# EAGLE design uc4h slcan adapter v101 (EAGLE 7.5.0)
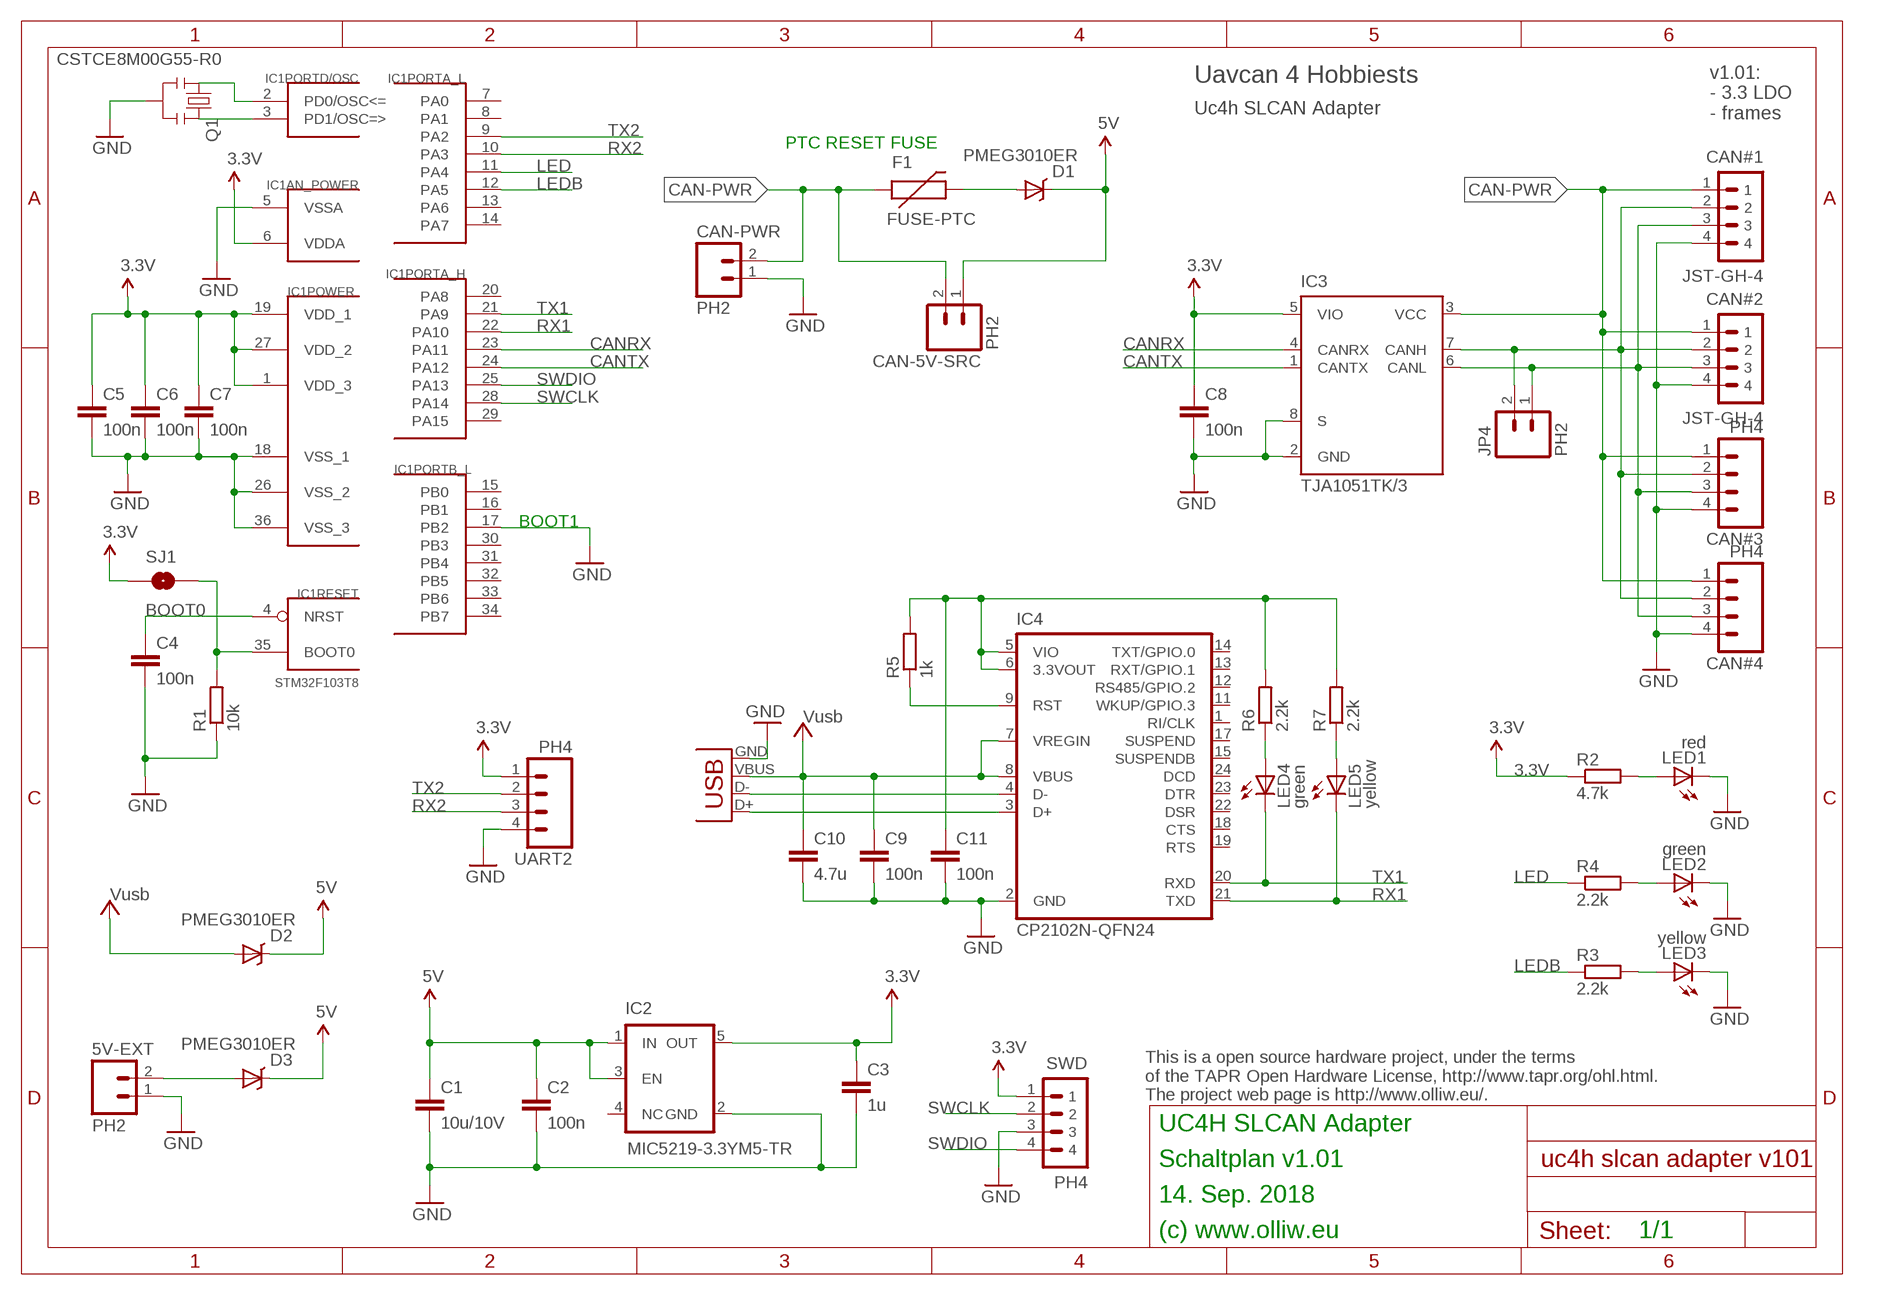
[diagram p0: schematic, sheet 1]

## Parts
5V-EXT  PH2  M02PTH  [1X02]
C1  10u/10V  C-EUC1206  [C1206]
C2  100n  C-EUC0603K  [C0603K]
C3  1u  C-EUC0603K  [C0603K]
C4  100n  C-EUC0603K  [C0603K]
C5  100n  C-EUC0603K  [C0603K]
C6  100n  C-EUC0603K  [C0603K]
C7  100n  C-EUC0603K  [C0603K]
C8  100n  C-EUC0603K  [C0603K]
C9  100n  C-EUC0603K  [C0603K]
C10  4.7u  C-EUC0805  [C0805]
C11  100n  C-EUC0603K  [C0603K]
CAN#1  JST-GH-4  [SM04B-GHS-TB]
CAN#2  JST-GH-4  [SM04B-GHS-TB]
CAN#3  PH4  M04PTH  [1X04]
CAN#4  PH4  M04PTH  [1X04]
CAN-5V-SRC  PH2  M02PTH  [1X02]
CAN-PWR  PH2  M02PTH  [1X02]
D1  PMEG3010ER  DIODE-SCHOTTKYSOD123-W  [SOD123W-DIODE]
D2  PMEG3010ER  DIODE-SCHOTTKYSOD123-W  [SOD123W-DIODE]
D3  PMEG3010ER  DIODE-SCHOTTKYSOD123-W  [SOD123W-DIODE]
F1  FUSE-PTC  [FUSE-1206]
IC1  STM32F103T8  STM32F10XTXU6  [VFQFPN36]
IC2  MIC5219-3.3YM5-TR  V_REG_TPS76433SOT23-5  [SOT23-5]
IC3  TJA1051TK/3  [HVSON8]
IC4  CP2102N-QFN24  [QFN24-CP2102N]
JP4  PH2  M02PTH  [1X02]
LED1  red  LEDCHIPLED_0603  [CHIPLED_0603]
LED2  green  LEDCHIPLED_0603  [CHIPLED_0603]
LED3  yellow  LEDCHIPLED_0603  [CHIPLED_0603]
LED4  green  LEDCHIPLED_0603  [CHIPLED_0603]
LED5  yellow  LEDCHIPLED_0603  [CHIPLED_0603]
Q1  CSTCE8M00G55-R0  RESONATORSMD  [RESONATOR-SMD]
R1  10k  R-EU_R0603  [R0603]
R2  4.7k  R-EU_R0603  [R0603]
R3  2.2k  R-EU_R0603  [R0603]
R4  2.2k  R-EU_R0603  [R0603]
R5  1k  R-EU_R0603  [R0603]
R6  2.2k  R-EU_R0603  [R0603]
R7  2.2k  R-EU_R0603  [R0603]
SJ1  BOOT0  SOLDERJUMPERNO  [SJ_2S-NO]
SWD  PH4  P4X1_1P27-OCT_BILEX  [4X1_1P27_OCT_BILEX]
UART2  PH4  M04PTH  [1X04]
USB  Amphenol 10118192-0001LF  USB-MICROB  [USB-MICROB]

## Nets
3.3V: C3.1 C5.1 C6.1 C7.1 C8.1 IC1.1(POWER:VDD_3) IC1.6(AN_POWER:VDDA) IC1.19(POWER:VDD_1) IC1.27(POWER:VDD_2) IC2.5(OUT) IC3.5(VIO) R2.1 SJ1.1 SWD.1 UART2.1
3.3V-CP2102: C11.1 IC4.5(VIO) IC4.6(3.3VOUT) R5.2 R6.2 R7.2
5V: C1.1 C2.1 CAN-5V-SRC.1 D1.C D2.C D3.C IC2.1(IN) IC2.3(EN)
5V-CAN-FUSE: D1.A F1.4
CAN-PWR: CAN#1.1 CAN#2.1 CAN#3.1 CAN#4.1 CAN-5V-SRC.2 CAN-PWR.2 F1.3 IC3.3(VCC)
CANH: CAN#1.2 CAN#2.2 CAN#3.2 CAN#4.2 IC3.7(CANH) JP4.2
CANL: CAN#1.3 CAN#2.3 CAN#3.3 CAN#4.3 IC3.6(CANL) JP4.1
CANRX: IC1.23(PORTA_H:PA11) IC3.4(CANRX)
CANTX: IC1.24(PORTA_H:PA12) IC3.1(CANTX)
GND: 5V-EXT.1 C1.2 C2.2 C3.2 C4.2 C5.2 C6.2 C7.2 C8.2 C9.2 C10.2 C11.2 CAN#1.4 CAN#2.4 CAN#3.4 CAN#4.4 CAN-PWR.1 IC1.5(AN_POWER:VSSA) IC1.17(PORTB_L:PB2) IC1.18(POWER:VSS_1) IC1.26(POWER:VSS_2) IC1.36(POWER:VSS_3) IC2.2(GND) IC3.2(GND) IC3.8(S) IC4.2(GND) LED1.C LED2.C LED3.C Q1.2 R1.1 SWD.3 UART2.4 USB.GND
LED: IC1.11(PORTA_L:PA4) R4.1
LEDB: IC1.12(PORTA_L:PA5) R3.1
N$1: C4.1 IC1.4(RESET:NRST)
N$2: LED3.A R3.2
N$3: IC1.35(RESET:BOOT0) R1.2 SJ1.2
N$5: IC1.2(PORTD/OSC:PD0/OSC<=) Q1.1
N$6: IC1.3(PORTD/OSC:PD1/OSC=>) Q1.3
N$8: LED2.A R4.2
N$9: LED1.A R2.2
N$10: 5V-EXT.2 D3.A
N$12: IC4.9(RST) R5.1
N$14: LED4.A R6.1
N$15: IC4.4(D-) USB.D-
N$16: LED5.A R7.1
N$17: IC4.3(D+) USB.D+
RX1: IC1.22(PORTA_H:PA10) IC4.21(TXD) LED5.C
RX2: IC1.10(PORTA_L:PA3) UART2.3
SWCLK: IC1.28(PORTA_H:PA14) SWD.2
SWDIO: IC1.25(PORTA_H:PA13) SWD.4
TX1: IC1.21(PORTA_H:PA9) IC4.20(RXD) LED4.C
TX2: IC1.9(PORTA_L:PA2) UART2.2
VUSB: C9.1 C10.1 D2.A IC4.7(VREGIN) IC4.8(VBUS) USB.VBUS ; supply symbol labelled Vusb
Unconnected: IC1.7(PORTA_L:PA0) IC1.8(PORTA_L:PA1) IC1.13(PORTA_L:PA6) IC1.14(PORTA_L:PA7) IC1.15(PORTB_L:PB0) IC1.16(PORTB_L:PB1) IC1.20(PORTA_H:PA8) IC1.29(PORTA_H:PA15) IC1.30(PORTB_L:PB3) IC1.31(PORTB_L:PB4) IC1.32(PORTB_L:PB5) IC1.33(PORTB_L:PB6) IC1.34(PORTB_L:PB7) IC2.4(NC) IC4.1(RI/CLK) IC4.11(WKUP/GPIO.3) IC4.12(RS485/GPIO.2) IC4.13(RXT/GPIO.1) IC4.14(TXT/GPIO.0) IC4.15(SUSPENDB) IC4.17(SUSPEND) IC4.18(CTS) IC4.19(RTS) IC4.22(DSR) IC4.23(DTR) IC4.24(DCD)

## Notes on the sheet
- v1.01:
  - 3.3 LDO
  - frames
- Uavcan 4 Hobbiests
- Uc4h SLCAN Adapter
- PTC RESET FUSE
- BOOT1
- This is a open source hardware project, under the terms
  of the TAPR Open Hardware License, http://www.tapr.org/ohl.html.
  The project web page is http://www.olliw.eu/.
- UC4H SLCAN Adapter
- Schaltplan v1.01
- 14. Sep. 2018
- (c) www.olliw.eu | 1/1

## Library data of the parts
5V-EXT CAN-5V-SRC CAN-PWR JP4 = # SparkFun2:M02: Header 2 Standard 2-pin 0.1" header. Use with straight break away headers (SKU : PRT-00116), right angle break away headers (PRT-00553), swiss pins (PRT-00743), machine pins (PRT-00117), and female headers (PRT-00115). Molex polarized connector foot print use with SKU : PRT-08233 with associated crimp pins and housings.
C1-C11 = rcl:C-EU: CAPACITOR, European symbol
CAN#1 CAN#2 = # stdlib:JST-GH-4
CAN#3 CAN#4 UART2 = # SparkFun2:M04: Header 4 Standard 4-pin 0.1" header. Use with straight break away headers (SKU : PRT-00116), right angle break away headers (PRT-00553), swiss pins (PRT-00743), machine pins (PRT-00117), and female headers (PRT-00115). Molex polarized connector foot print use with SKU : PRT-08231 with associated crimp pins and housings. 1MM SMD Version SKU: PRT-10208
D1-D3 = # stdlib:DIODE-SCHOTTKY
F1 = # stdlib:FUSE-PTC
IC1 = # stm32:STM32F10XTXU6: STM32F101/103 36pad VFQPFN36
IC2 = # SparkFun2:V_REG_TPS76433: Voltage Regulator Older TI part. LDO 150mA regulator. No output by-pass cap option. See V_REG_LDO for a better part.
IC3 = # stdlib:TJA1051TK/3
IC4 = # stdlib:CP2102N-QFN24
LED1-LED5 = led:LED: LED OSRAM: - CHIPLED LG R971, LG N971, LY N971, LG Q971, LY Q971, LO R971, LY R971 LH N974, LH R974 LS Q976, LO Q976, LY Q976 LO Q996 - Hyper CHIPLED LW Q18S LB Q993, LB Q99A, LB R99A - SideLED LS A670, LO A670, LY A670, LG A670, LP A670 LB A673, LV A673, LT A673, LW A673 LH A674 LY A675 LS A676, LA A676, LO A676, LY A676, LW A676 LS A679, LY A679, LG A679 - Hyper Micro SIDELED® LS Y876, LA Y876, LO Y876, LY Y876 LT Y87S - SmartLED LW L88C, LW L88S LB L89C, LB L89S, LG L890 LS L89K, LO L89K, LY L89K LS L896, LA L896, LO L896, LY L896 - TOPLED LS T670, LO T670, LY T670, LG T670, LP T670 LSG T670, LSP T670, LSY T670, LOP T670, LYG T670 LG T671, LOG T671, LSG T671 LB T673, LV T673, LT T673, LW T673 LH T674 LS T676, LA T676, LO T676, LY T676, LB T676, LH T676, LSB T676, LW T676 LB T67C, LV T67C, LT T67C, LS T67K, LO T67K, LY T67K, LW E67C LS E67B, LA E67B, LO E67B, LY E67B, LB E67C, LV E67C, LT E67C LW T67C LS T679, LY T679, LG T679 LS T770, LO T770, LY T770, LG T770, LP T770 LB T773, LV T773, LT T773, LW T773 LH T774 LS E675, LA E675, LY E675, LS T675 LS T776, LA T776, LO T776, LY T776, LB T776 LHGB T686 LT T68C, LB T68C - Hyper Mini TOPLED® LB M676 - Mini TOPLED Santana® LG M470 LS M47K, LO M47K, LY M47K Source: http://www.osram.convergy.de LUXEON: - LUMILED® LXK2-PW12-R00, LXK2-PW12-S00, LXK2-PW14-U00, LXK2-PW14-V00 LXK2-PM12-R00, LXK2-PM12-S00, LXK2-PM14-U00 LXK2-PE12-Q00, LXK2-PE12-R00, LXK2-PE12-S00, LXK2-PE14-T00, LXK2-PE14-U00 LXK2-PB12-K00, LXK2-PB12-L00, LXK2-PB12-M00, LXK2-PB14-N00, LXK2-PB14-P00, LXK2-PB14-Q00 LXK2-PR12-L00, LXK2-PR12-M00, LXK2-PR14-Q00, LXK2-PR14-R00 LXK2-PD12-Q00, LXK2-PD12-R00, LXK2-PD12-S00 LXK2-PH12-R00, LXK2-PH12-S00 LXK2-PL12-P00, LXK2-PL12-Q00, LXK2-PL12-R00 Source: www.luxeon.com KINGBRIGHT: KA-3528ASYC Source: www.kingbright.com
Q1 = # SparkFun2:RESONATOR: Resonator Small SMD resonator. This is the itty bitty 10/20MHz resonators with built in caps. CSTCE10M0G55 and CSTCE20M0V53. Footprint has been reviewed closely but hasn't been tested yet.
R1-R7 = rcl:R-EU_: RESISTOR, European symbol
SJ1 = # SparkFun2:SOLDERJUMPER: Solder Jumper Standard SMD solder jumper. Used to automate production. Two varients : Normally Open and Normally Closed are the same, but have different paste layers. NC will have a large amount of paste and should jumper during reflow.
SWD = # stdlib:P4X1_1P27
USB = # SparkFun2:USB: USB Connectors USB-B-PTH is fully proven SKU : PRT-00139 USB-miniB is fully proven SKU : PRT-00587 USB-A-PCB is untested. USB-A-H is throughly reviewed, but untested. Spark Fun Electronics SKU : PRT-00437 USB-B-SMT is throughly reviewed, but untested. Needs silkscreen touching up. USB-A-S has not been used/tested USB-MB-H has not been used/tested

## Board
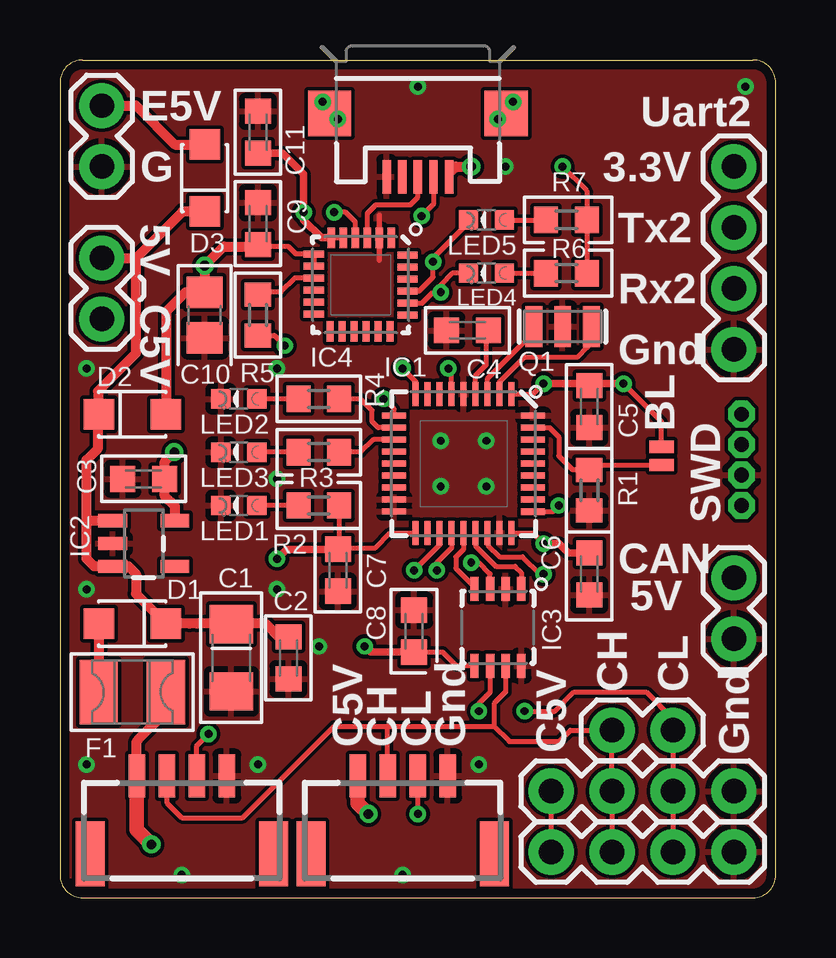
[diagram p1: board, top side]
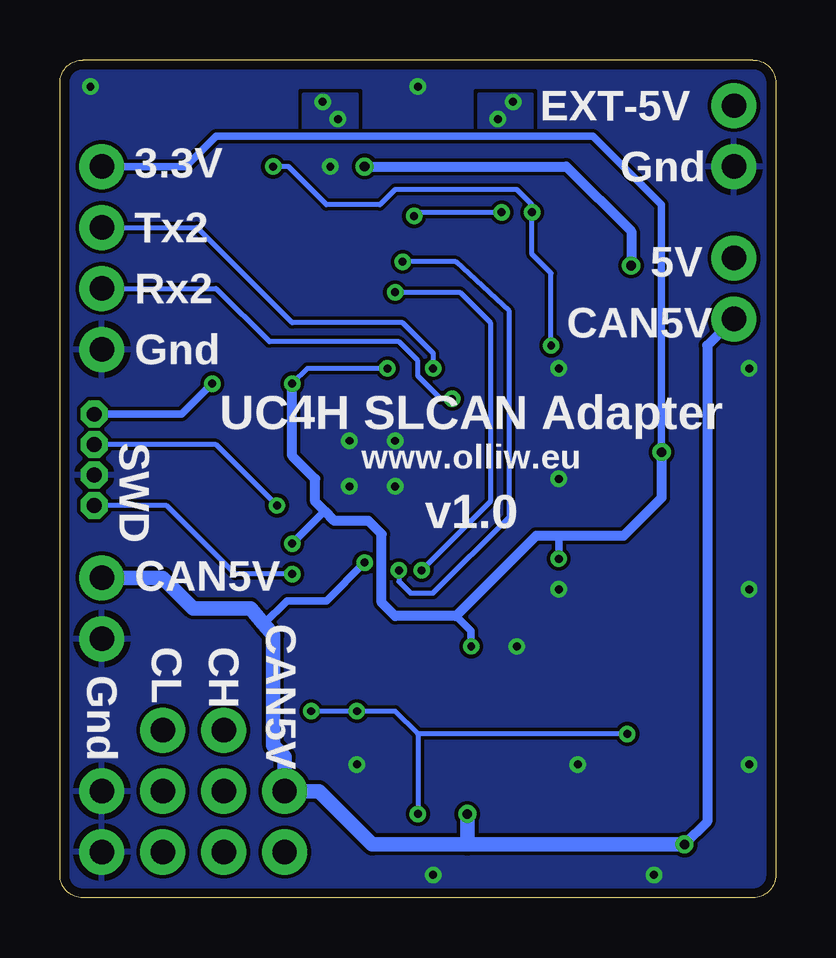
[diagram p2: board, bottom side, seen from below]

Size 29.84 x 34.92 mm. Coordinates in mm from the lower left corner, seen from the top.
Outline: 0.95,34.92 28.89,34.92 arc-90 29.84,33.97 29.84,0.95 arc-90 28.89,0 0.95,0 arc-90 0,0.95 0,33.97 arc-90 0.95,34.92
Copper layers (1*16): Top 0.0356mm / dielectric 1.5011mm / Bottom 0.0356mm
Design rules "ow-oshpark-2layer": minimum track width 6mil, minimum drill 13mil, track to track 6mil, track to pad 6mil, pad to pad 6mil, via to via 6mil, smd to smd 6mil, copper to edge 15mil, drill to drill 6mil, minimum pad ring 7mil, minimum via ring 7mil, stop-mask expansion 2.5mil, vias tented up to drill 26mil, thermal gap 10mil

### Footprints (pad centres in the part's own frame; a part is rotated, then mirrored left to right if it is on the bottom)
1X02 = drill 1.016 pad 1.88: 1 0,0; 2 2.54,0
C1206 = smd 1.6 x 1.8: 1 -1.4,0; 2 1.4,0
C0603K = smd 1.05 x 1.08: 1 -0.875,0; 2 0.875,0
C0805 = smd 1.3 x 1.5: 1 -0.95,0; 2 0.95,0
SM04B-GHS-TB = smd 0.7 x 1.8: 1 -1.875,4.6; 2 -0.625,4.6; 3 0.625,4.6; 4 1.875,4.6 | smd 1.2 x 2.7: FIT@1 -3.825,1.35; FIT@2 3.825,1.35
1X04 = drill 1.016 pad 1.88: 1 0,0; 2 2.54,0; 3 5.08,0; 4 7.62,0
SOD123W-DIODE = smd 1.27 x 1.27: A -1.4,0; C 1.4,0
FUSE-1206 = smd 1.6 x 2.7: 3 -1.4,0; 4 1.4,0
VFQFPN36 = smd 1 x 0.25: 1 -2.9,2; 2 -2.9,1.5; 3 -2.9,1; 4 -2.9,0.5; 5 -2.9,0; 6 -2.9,-0.5; 7 -2.9,-1; 8 -2.9,-1.5; 9 -2.9,-2; 19 2.9,-2; 20 2.9,-1.5; 21 2.9,-1; 22 2.9,-0.5; 23 2.9,0; 24 2.9,0.5; 25 2.9,1; 26 2.9,1.5; 27 2.9,2 | smd 0.25 x 1: 10 -2,-2.9; 11 -1.5,-2.9; 12 -1,-2.9; 13 -0.5,-2.9; 14 0,-2.9; 15 0.5,-2.9; 16 1,-2.9; 17 1.5,-2.9; 18 2,-2.9; 29 1.5,2.9; 30 1,2.9; 31 0.5,2.9; 32 0,2.9; 33 -0.5,2.9; 34 -1,2.9; 35 -1.5,2.9; 36 -2,2.9 | smd 0.27 x 1: 28 2,2.9
SOT23-5 = smd 0.55 x 1.2: 1 -0.95,-1.3; 2 0,-1.3; 3 0.95,-1.3; 4 0.95,1.3; 5 -0.95,1.3
HVSON8 = smd 1 x 0.35: 1 -1.6,0.975; 2 -1.6,0.325; 3 -1.6,-0.325; 4 -1.6,-0.975; 5 1.6,-0.975; 6 1.6,-0.325; 7 1.6,0.325; 8 1.6,0.975
QFN24-CP2102N = smd 0.85 x 0.3: 1 -1.95,1.275; 2 -1.95,0.775; 3 -1.95,0.275; 4 -1.95,-0.225; 5 -1.95,-0.725; 6 -1.95,-1.225; 13 1.95,-1.275; 14 1.95,-0.775; 15 1.95,-0.275; 16 1.95,0.225; 17 1.95,0.725; 18 1.95,1.225 | smd 0.3 x 0.85: 7 -1.275,-1.95; 8 -0.775,-1.95; 9 -0.275,-1.95; 10 0.225,-1.95; 11 0.725,-1.95; 12 1.225,-1.95; 19 1.275,1.95; 20 0.775,1.95; 21 0.275,1.95; 22 -0.225,1.95; 23 -0.725,1.95; 24 -1.225,1.95
CHIPLED_0603 = smd 0.8 x 0.8: A 0,-0.75; C 0,0.75
RESONATOR-SMD = smd 0.7 x 1.7: 1 -1.2,0; 2 0,0; 3 1.2,0
R0603 = smd 1 x 1.1: 1 -0.85,0; 2 0.85,0
SJ_2S-NO = smd 0.508 x 1.016: 1 -0.381,0; 2 0.381,0
4X1_1P27_OCT_BILEX = drill 0.61 pad 1.118 octagon: 1 0,0; 2 0,-1.27; 3 0,-2.54; 4 0,-3.81
USB-MICROB = smd 0.35 x 1.4: D+ 0,2.65; D- -0.65,2.65; GND 1.3,2.65; ID 0.65,2.65; VBUS -1.3,2.65 | smd 1.8 x 1.9: MT1 -3.683,0; MT2 3.683,0

### Placement (x,y rotation side)
5V-EXT  1.75,30.48 90 top
C1  7.14,10 270 top
C2  9.53,10 270 top
C3  3.49,17.46 180 top
C4  16.99,23.65 180 top
C5  22.07,20.48 270 top
C6  22.07,13.49 270 top
C7  11.59,13.65 270 top
C8  14.76,11.11 90 top
C9  8.26,28.1 90 top
C10  6.03,24.29 270 top
C11  8.26,31.91 90 top
CAN#1  5.08,0.48 0 top
CAN#2  14.29,0.48 0 top
CAN#3  20.48,1.91 0 top
CAN#4  20.48,4.45 0 top
CAN-5V-SRC  1.75,26.67 270 top
CAN-PWR  28.1,10.79 90 top
D1  3.02,11.43 0 top
D2  3.02,20.16 180 top
D3  6.03,30 270 top
F1  3.02,8.57 180 top
IC1  16.83,18.1 270 top
IC2  3.49,14.76 270 top
IC3  18.26,11.27 270 top
IC4  12.54,25.56 270 top
JP4  25.56,6.99 180 top
LED1  7.46,16.35 90 top
LED2  7.46,20.8 90 top
LED3  7.46,18.57 90 top
LED4  17.78,26.04 90 top
LED5  17.78,28.26 90 top
Q1  20.95,23.81 180 top
R1  22.07,16.99 90 top
R2  10.79,16.35 180 top
R3  10.79,18.57 180 top
R4  10.79,20.8 180 top
R5  8.26,24.29 270 top
R6  21.11,26.04 0 top
R7  21.11,28.26 0 top
SJ1  25.08,18.41 270 top
SWD  28.42,20.16 0 top
UART2  28.1,30.48 270 top
USB  14.92,32.7 180 top

### Tracks (layer width: path | path; a pad name or v marks a point on that pad's centre or on a via)
3.3V  (via drill 0.33, 0.4)
  Top 0.203: R2.1 11.64,14.58 | 11.64,14.58 C7.1 | IC3.5 16.52,9.67 15.96,10.24 C8.1 | IC1.27 19.73,15.2 v20.16,14.76 | IC1.19 13.77,15.2 13.15,14.58 11.64,14.58 | IC1.1 19.73,21 v20.16,21.43 | 21.99,21.43 C5.1 | SJ1.1 25.08,19.84 v23.5,21.43 | IC1.6 16.33,21.88 v16.19,22.07
  Top 0.305: C6.1 21.19,14.37 20.8,14.76 v20.16,14.76 | v20.16,21.43 21.99,21.43 v23.5,21.43 | C7.1 9.45,14.53 v9.05,14.13 | C8.1 12.94,10.24 v12.7,10.48
  Top 0.406: v4.76,18.57 4.37,18.18 C3.1 4.37,16.75 4.79,16.32 IC2.5
  Bottom 0.203: v16.19,22.07 19.53,22.07 v20.16,21.43
  Bottom 0.305: SWD.1 24.77,20.16 v23.5,21.43 | v4.76,18.57 4.76,28.89 7.62,31.75 23.34,31.75 24.61,30.48 UART2.1 | 18.81,16.11 v20.16,14.76 | v12.7,10.48 12.7,11.11 13.34,11.75 | v9.05,14.13 9.05,15.08
  Bottom 0.406: v4.76,18.57 4.76,16.67 6.35,15.08 9.05,15.08 10,15.08 13.34,11.75 15.88,11.75 16.43,12.3 16.43,15.16 16.99,15.72 18.41,15.72 18.81,16.11 19.21,16.51 19.21,17.46 20.16,18.41 v20.16,21.43
3.3V-CP2102  (via drill 0.33)
  Top 0.203: R6.2 R7.2 21.96,29.47 v20.95,30.48 | IC4.6 IC4.5 | R5.2 8.95,23.44 v9.37,23.02
  Top 0.305: C11.1 9.29,31.03 10.16,30.16 v10.16,28.57 10.16,28.26 10.91,27.51 IC4.6
  Bottom 0.203: v20.95,30.48 20.32,30.48 18.73,28.89 16.51,28.89 15.88,29.53 10.79,29.53 10.16,28.89 v10.16,28.57 10.16,26.83 9.37,26.04 v9.37,23.02
5V
  Top 0.203: 7.22,11.19 C1.1 | IC2.1 | 1.59,20.13 D2.C | 1.11,15.71 1.11,15.72
  Top 0.406: C1.1 7.14,11.11 6.83,11.43 5.72,11.43 5.4,11.43 D1.C 3.17,12.67 3.17,13.49 2.85,13.81 IC2.3 1.43,13.81 1.11,14.13 1.11,15.72 1.11,18.26 1.59,18.73 1.59,20.13 | C2.1 9.21,10.79 8.57,11.43 6.99,11.43 7.46,11.19 7.22,11.19 | IC2.1 1.11,15.71 | D2.C 1.59,20.19 1.59,21.11 3.17,22.7 3.17,26.67 | D3.C 5.11,28.6 3.17,26.67 | CAN-5V-SRC.1 3.17,26.67
5V-CAN-FUSE
  Top 0.406: D1.A F1.4
CAN-PWR  (via drill 0.33, 0.4)
  Top 0.203: IC3.3 17.93,13.5 17.46,13.97 v17.14,13.97 | CAN#4.1 CAN#3.1 | 4.45,7.78 4.45,8.54 | 3.21,6.54 3.25,6.58 | 3.21,2.83 3.25,2.79 | 12.41,3.94 12.45,3.9
  Top 0.406: 3.25,6.58 4.45,7.78 | CAN#1.1 3.21,6.54 | 4.45,8.54 F1.3
  Top 0.61: 3.25,2.79 v3.81,2.22 | 12.45,3.9 v12.86,3.49 | CAN#1.1 3.21,2.83 | CAN#2.1 12.41,3.94
  Bottom 0.305: v17.14,13.97 18.73,12.38 20.38,12.38 21.35,11.41
  Bottom 0.406: CAN-5V-SRC.2 2.86,23.02 2.86,3.17 v3.81,2.22
  Bottom 0.61: CAN-PWR.2 25.56,13.34 24.29,12.06 21.91,12.06 21.35,11.41 20.95,10.95 20.95,6.35 20.48,5.87 CAN#4.1 19.05,4.45 16.83,2.22 12.86,2.22 | v3.81,2.22 12.86,2.22 | v12.86,3.49 12.86,2.22
CANH
  Top 0.203: IC3.7 18.58,8.58 18.1,8.1 18.1,7.14 | CAN#3.2 CAN#4.2 JP4.2 21.27,6.99 20.8,6.51 18.73,6.51 18.1,7.14 | 13.65,7.14 11.43,7.14 7.62,3.33 5.08,3.33 4.46,3.96 CAN#1.2 | 13.65,7.14 18.1,7.14 | CAN#2.2 13.66,7.13 13.65,7.14
CANL  (via drill 0.33)
  Top 0.203: IC3.6 17.93,8.56 17.46,8.1 v17.46,7.78 | CAN#3.3 CAN#4.3 JP4.1 25.56,7.46 24.45,8.57 21.43,8.57 20.64,7.78 v19.37,7.78 | v6.19,6.83 5.71,6.34 CAN#1.3 | CAN#2.3 14.91,3.5 v14.92,3.49
  Bottom 0.203: v19.37,7.78 v17.46,7.78 15.88,7.78 14.92,6.83 | v6.19,6.83 14.92,6.83 | 14.92,6.83 v14.92,3.49
CANRX
  Top 0.203: IC1.23 16.83,14.53 16.51,14.21 16.51,13.73 16.83,13.41 17.29,12.94 IC3.4
CANTX
  Top 0.203: IC1.24 17.33,14.66 18.18,13.81 18.97,13.81 19.23,13.55 IC3.1
GND  (via drill 0.33)
  Top 0.203: 13.31,28.47 13.31,26.56
  other vias: 28.57,33.81 1.11,22.07 1.11,12.86 1.11,5.56 17.46,5.56 8.26,5.56 15.88,19.05 17.78,19.05 17.78,17.14 15.88,17.14 9.05,17.46 9.05,12.86 9.05,22.07 18.57,30.48 10.79,10.48 14.29,0.95 5.08,0.95 14.92,33.81
  pour Bottom (isolate 0.152, rank 2): 0,34.92 29.84,34.92 29.84,0 0,0
  pour Top (isolate 0.152, rank 6): 0,34.92 29.84,34.92 29.84,0 0,0
LED
  Top 0.203: R4.1 12.54,20.8 13.02,20.32 13.02,19.84 13.26,19.6 IC1.11
LEDB
  Top 0.203: R3.1 12.54,18.57 13.06,19.1 IC1.12
N$1
  Top 0.203: IC1.4 17.33,21.77 17.78,22.23 17.78,23.65 C4.1
N$2
  Top 0.203: R3.2 LED3.A
N$3
  Top 0.203: IC1.35 20.41,19.6 20.8,19.21 20.8,18.41 21.38,17.84 R1.2 22.11,18.03 SJ1.2
N$4  (via drill 0.33)
  other vias: 18.89,33.18 18.26,32.46
  pour Bottom: 17.46,33.5 19.68,33.5 19.68,32.07 17.46,32.07
N$5
  Top 0.203: IC1.2 18.33,21.5 19.37,22.54 21.59,22.54 22,22.95 Q1.1
N$6
  Top 0.203: IC1.3 17.83,21.64 19.6,23.41 Q1.3
N$7  (via drill 0.33)
  other vias: 10.95,33.18 11.59,32.46
  pour Bottom (no thermals): 10.16,33.5 10.16,32.07 12.38,32.07 12.38,33.5
N$8
  Top 0.203: R4.2 LED2.A
N$9
  Top 0.203: R2.2 LED1.A
N$10
  Top 0.406: 5V-EXT.2 3.17,33.02 4.79,31.4 D3.A
N$12
  Top 0.203: IC4.9 9.8,25.83 9.21,25.24 8.36,25.24 R5.1
N$14
  Top 0.203: LED4.A R6.1
N$15  (via drill 0.33)
  Top 0.203: USB.D- 15.57,28.91 v15.08,28.42 | IC4.4 12.32,28.16 11.91,28.57 v11.43,28.57
  Bottom 0.203: v15.08,28.42 14.92,28.57 v11.43,28.57
N$16
  Top 0.203: LED5.A R7.1
N$17
  Top 0.203: USB.D+ 14.92,29.21 14.61,28.89 13.18,28.89 12.82,28.53 IC4.3
RX1  (via drill 0.33)
  Top 0.203: LED5.C 16.99,28.1 15.56,26.67 v15.56,26.51 15.56,25.88 14.96,25.28 IC4.21 | IC1.22 16.33,14.58 15.72,13.97 v15.72,13.65
  Bottom 0.203: v15.72,13.65 15.72,13.18 15.24,12.7 14.29,12.7 11.11,15.88 11.11,24.45 13.34,26.51 v15.56,26.51
RX2  (via drill 0.33)
  Top 0.203: IC1.10 13.93,20.36 v13.49,20.8
  Bottom 0.203: UART2.3 23.34,25.4 21.11,23.18 15.72,23.18 14.92,22.38 14.92,21.75 13.97,20.8 v13.49,20.8
SWCLK  (via drill 0.33)
  Top 0.203: IC1.28 20.54,16.1 v20.8,16.35
  Bottom 0.203: v20.8,16.35 23.34,18.89 SWD.2
SWDIO  (via drill 0.33)
  Top 0.203: IC1.25 17.83,14.72 18.34,14.21 19.29,14.21 20,13.49 v20.16,13.49
  Bottom 0.203: v20.16,13.49 22.54,13.49 25.4,16.35 SWD.4
TX1  (via drill 0.33)
  Top 0.203: IC1.21 15.83,14.72 v14.76,13.65 | LED4.C 16.35,26.04 15.88,25.56 v15.88,25.24 15.56,25.24 15.1,24.78 IC4.20
  Bottom 0.203: v15.88,25.24 13.18,25.24 11.91,23.97 11.91,16.51 v14.76,13.65
TX2  (via drill 0.33)
  Top 0.203: IC1.9 14.83,21.53 v14.29,22.07
  Bottom 0.203: UART2.2 24.13,27.94 20.16,23.97 15.56,23.97 14.29,22.7 v14.29,22.07
VUSB  (via drill 0.4)
  Top 0.203: IC4.8 IC4.7 9.84,26.83 9.53,27.15 8.33,27.15
  Top 0.305: USB.VBUS 16.22,30.13 16.35,30.32
  Top 0.406: 16.35,30.32 16.51,30.48 v17.14,30.48 | 8.33,27.15 C9.1 8.18,27.15 6.83,27.15 v6.03,26.35 C10.1 5.24,25.24 4.45,24.45 4.45,20.64 4.42,20.51 D2.A
  Bottom 0.406: v17.14,30.48 8.73,30.48 6.03,27.78 v6.03,26.35

### Text on the board
tNames: E5V | Uart2 | G | 3.3V | 5V | Tx2 | C5V | Rx2 | Gnd | BL | SWD | CAN / 5V | CH | CL | C5V | CH | CL | Gnd | C5V | Gnd
bNames: EXT-5V | Gnd | 3.3V | Tx2 | 5V | Rx2 | CAN5V | Gnd | UC4H SLCAN Adapter | www.olliw.eu | SWD | v1.0 | CAN5V | CAN5V | CH | CL | Gnd